# EAGLE design integrated_winglevlr_pow_and_cpu (EAGLE 9.6.2)
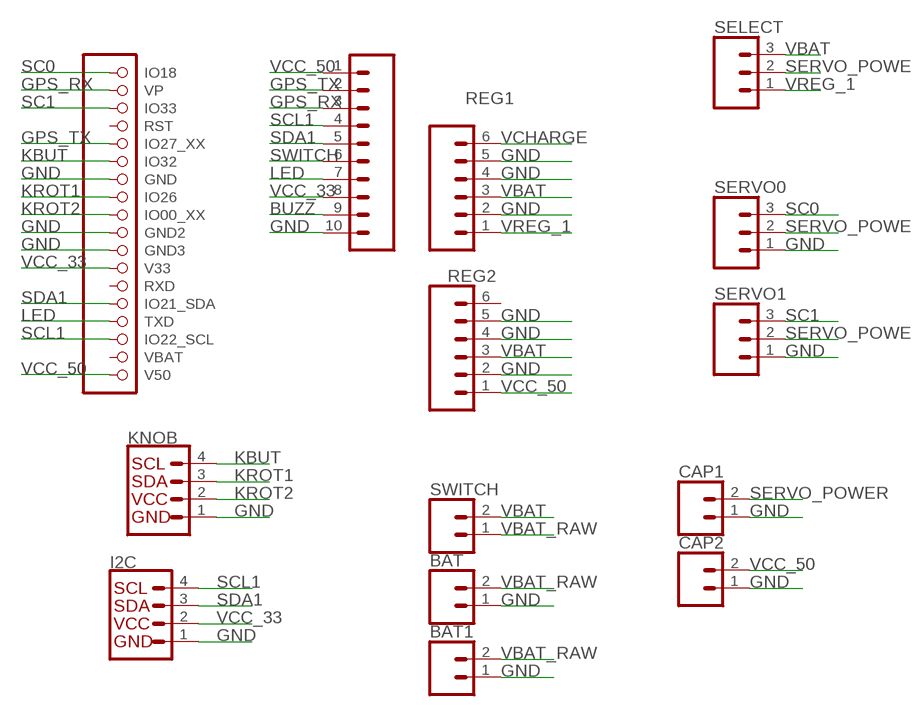
[diagram p0: schematic, sheet 1]

## Parts
BAT  CONN_02  [1X02]
BAT1  CONN_02  [1X02]
CAP1  CONN_02  [1X02]
CAP2  CONN_02  [1X02]
I2C  Vertical Qwiic Connector  QWIIC_CONNECTOR  [JST04_1MM_VERT]
J2  CONN_10  [1X10-1.25MM]
JP1  000_ESP32_D1MINI  [00_2X9]
KNOB  Vertical Qwiic Connector  QWIIC_CONNECTOR  [JST04_1MM_VERT]
REG1  CONN_06SILK_FEMALE_PTH  [1X06]
REG2  CONN_06SILK_FEMALE_PTH  [1X06]
SELECT  455-1750-1-ND  CONN_03  [1X03]
SERVO0  455-1750-1-ND  CONN_03  [1X03]
SERVO1  455-1750-1-ND  CONN_03  [1X03]
SWITCH  CONN_02  [1X02]

## Nets
BUZZ: J2.9
GND: BAT1.1 BAT.1 CAP1.1 CAP2.1 I2C.1 J2.10 JP1.7(GND) JP1.10(GND2) JP1.11(GND3) KNOB.1 REG1.2 REG1.4 REG1.5 REG2.2 REG2.4 REG2.5 SERVO0.1 SERVO1.1
GPS_RX: J2.3 JP1.2(VP)
GPS_TX: J2.2 JP1.5(IO27_XX)
KBUT: JP1.6(IO32) KNOB.4
KROT1: JP1.8(IO26) KNOB.3
KROT2: JP1.9(IO00_XX) KNOB.2
LED: J2.7 JP1.15(TXD)
SC0: JP1.1(IO18) SERVO0.3
SC1: JP1.3(IO33) SERVO1.3
SCL1: I2C.4 J2.4 JP1.16(IO22_SCL)
SDA1: I2C.3 J2.5 JP1.14(IO21_SDA)
SERVO_POWER: CAP1.2 SELECT.2 SERVO0.2 SERVO1.2
SWITCH: J2.6
VBAT: REG1.3 REG2.3 SELECT.3 SWITCH.2
VBAT_RAW: BAT1.2 BAT.2 SWITCH.1
VCC_33: I2C.2 J2.8 JP1.12(V33)
VCC_50: CAP2.2 J2.1 JP1.18(V50) REG2.1
VCHARGE: REG1.6
VREG_1: REG1.1 SELECT.1
Unconnected: JP1.4(RST) JP1.13(RXD) JP1.17(VBAT) REG2.6

## Library data of the parts
BAT BAT1 CAP1 CAP2 SWITCH = SparkFun-Connectors:CONN_02: Multi connection point. Often used as Generic Header-pin footprint for 0.1 inch spaced/style header connections On any of the 0.1 inch spaced packages, you can populate with these: Break Away Headers - Straight <https://www.sparkfun.com/products/116> (PRT-00116) Break Away Male Headers - Right Angle <https://www.sparkfun.com/products/553> (PRT-00553) Female Headers <https://www.sparkfun.com/products/115> (PRT-00115) Break Away Headers - Machine Pin <https://www.sparkfun.com/products/117> (PRT-00117) Break Away Female Headers - Swiss Machine Pin <https://www.sparkfun.com/products/743> (PRT-00743) For SCREWTERMINALS and SPRING TERMINALS visit here: Screw Terimnals on SparkFun.com <https://www.sparkfun.com/search/results?term=Screw+Terminals> (5mm/3.5mm/2.54mm spacing) This device is also useful as a general connection point to wire up your design to another part of your project. Our various solder wires solder well into these plated through hole pads. Hook-Up Wire - Assortment (Stranded, 22 AWG) <https://www.sparkfun.com/products/11375> (PRT-11375) Hook-Up Wire - Assortment (Solid Core, 22 AWG) <https://www.sparkfun.com/products/11367> (PRT-11367) View the entire wire category on our website here <https://www.sparkfun.com/categories/141> Special notes: Molex polarized connector foot print use with: PRT-08233 with associated crimp pins and housings. 2.54_SCREWTERM for use with PRT-10571. 3.5mm Screw Terminal footprints for PRT-08084 5mm Screw Terminal footprints for use with PRT-08432
I2C KNOB = SparkFun-Connectors:QWIIC_CONNECTOR: SparkFun I2C Standard Qwiic Connector An SMD 1mm pitch JST connector makes it easy and quick (get it? Qwiic?) to connect I2C devices to each other. The Qwiic system <http://www.sparkfun.com/qwiic> enables fast and solderless connection between popular platforms and various sensors and actuators. We carry 200mm <https://www.sparkfun.com/products/14204>, 100mm <https://www.sparkfun.com/products/14205>, 50mm <https://www.sparkfun.com/products/14206>, and breadboard friendly <https://www.sparkfun.com/products/14207> Qwiic cables. We also offer 10 pcs strips <https://www.sparkfun.com/products/14323> the SMD connectors.; PROD_ID: CONN-14483
J2 = SparkFun-Connectors:CONN_10: Multi connection point. Often used as Generic Header-pin footprint for 0.1 inch spaced/style header connections On any of the 0.1 inch spaced packages, you can populate with these: Break Away Headers - Straight <https://www.sparkfun.com/products/116> (PRT-00116) Break Away Male Headers - Right Angle <https://www.sparkfun.com/products/553> (PRT-00553) Female Headers <https://www.sparkfun.com/products/115> (PRT-00115) Break Away Headers - Machine Pin <https://www.sparkfun.com/products/117> (PRT-00117) Break Away Female Headers - Swiss Machine Pin <https://www.sparkfun.com/products/743> (PRT-00743) Arduino Stackable Header - 10 Pin <https://www.sparkfun.com/products/11376> (PRT-11376) For SCREWTERMINALS and SPRING TERMINALS visit here: Screw Terimnals on SparkFun.com <https://www.sparkfun.com/search/results?term=Screw+Terminals> (5mm/3.5mm/2.54mm spacing) This device is also useful as a general connection point to wire up your design to another part of your project. Our various solder wires solder well into these plated through hole pads. Hook-Up Wire - Assortment (Stranded, 22 AWG) <https://www.sparkfun.com/products/11375> (PRT-11375) Hook-Up Wire - Assortment (Solid Core, 22 AWG) <https://www.sparkfun.com/products/11367> (PRT-11367) View the entire wire category on our website here <https://www.sparkfun.com/categories/141> Special notes: Molex polarized connector foot print use with SKU : PRT-08231 with associated crimp pins and housings. 1MM SMD Version SKU: PRT-10208 NOTES ON THE VARIANTS LOCK and LOCK_LONGPADS... This footprint was designed to help hold the alignment of a through-hole component (i.e. 6-pin header) while soldering it into place. You may notice that each hole has been shifted either up or down by 0.005 of an inch from it's more standard position (which is a perfectly straight line). This slight alteration caused the pins (the squares in the middle) to touch the edges of the holes. Because they are alternating, it causes a "brace" to hold the component in place. 0.005 has proven to be the perfect amount of "off-center" position when using our standard breakaway headers. Although looks a little odd when you look at the bare footprint, once you have a header in there, the alteration is very hard to notice. Also,if you push a header all the way into place, it is covered up entirely on the bottom side.
JP1 = microbuilder:000_ESP32_D1MINI: PIN HEADER
REG1 REG2 = SparkFun-Connectors:CONN_06: Multi connection point. Often used as Generic Header-pin footprint for 0.1 inch spaced/style header connections On any of the 0.1 inch spaced packages, you can populate with these: Break Away Headers - Straight <https://www.sparkfun.com/products/116> (PRT-00116) Break Away Male Headers - Right Angle <https://www.sparkfun.com/products/553> (PRT-00553) Female Headers <https://www.sparkfun.com/products/115> (PRT-00115) Break Away Headers - Machine Pin <https://www.sparkfun.com/products/117> (PRT-00117) Break Away Female Headers - Swiss Machine Pin <https://www.sparkfun.com/products/743> (PRT-00743) Arduino Stackable Header - 6 Pin <https://www.sparkfun.com/products/9280> (PRT-09280) For SCREWTERMINALS and SPRING TERMINALS visit here: Screw Terimnals on SparkFun.com <https://www.sparkfun.com/search/results?term=Screw+Terminals> (5mm/3.5mm/2.54mm spacing) This device is also useful as a general connection point to wire up your design to another part of your project. Our various solder wires solder well into these plated through hole pads. Hook-Up Wire - Assortment (Stranded, 22 AWG) <https://www.sparkfun.com/products/11375> (PRT-11375) Hook-Up Wire - Assortment (Solid Core, 22 AWG) <https://www.sparkfun.com/products/11367> (PRT-11367) View the entire wire category on our website here <https://www.sparkfun.com/categories/141>; PROD_ID: CONN-08437
SELECT SERVO0 SERVO1 = SparkFun-Connectors:CONN_03: Multi connection point. Often used as Generic Header-pin footprint for 0.1 inch spaced/style header connections On any of the 0.1 inch spaced packages, you can populate with these: Break Away Headers - Straight <https://www.sparkfun.com/products/116> (PRT-00116) Break Away Male Headers - Right Angle <https://www.sparkfun.com/products/553> (PRT-00553) Female Headers <https://www.sparkfun.com/products/115> (PRT-00115) Break Away Headers - Machine Pin <https://www.sparkfun.com/products/117> (PRT-00117) Break Away Female Headers - Swiss Machine Pin <https://www.sparkfun.com/products/743> (PRT-00743) Stackable Header - 3 Pin (Female, 0.1") <https://www.sparkfun.com/products/13875> (PRT-13875) For SCREWTERMINALS and SPRING TERMINALS visit here: Screw Terimnals on SparkFun.com <https://www.sparkfun.com/search/results?term=Screw+Terminals> (5mm/3.5mm/2.54mm spacing) This device is also useful as a general connection point to wire up your design to another part of your project. Our various solder wires solder well into these plated through hole pads. Hook-Up Wire - Assortment (Stranded, 22 AWG) <https://www.sparkfun.com/products/11375> (PRT-11375) Hook-Up Wire - Assortment (Solid Core, 22 AWG) <https://www.sparkfun.com/products/11367> (PRT-11367) View the entire wire category on our website here <https://www.sparkfun.com/categories/141> Special notes: Molex polarized connector foot print use with SKU : PRT-08232 with associated crimp pins and housings.; PROD_ID: XXX-00000

## Net classes
3 hc: width 0.762 mm

## Board
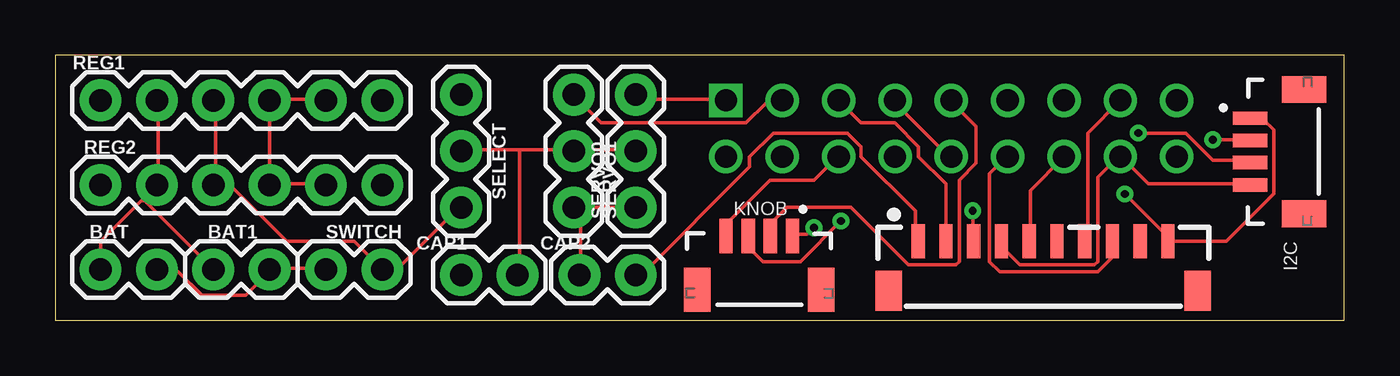
[diagram p1: board, top side]
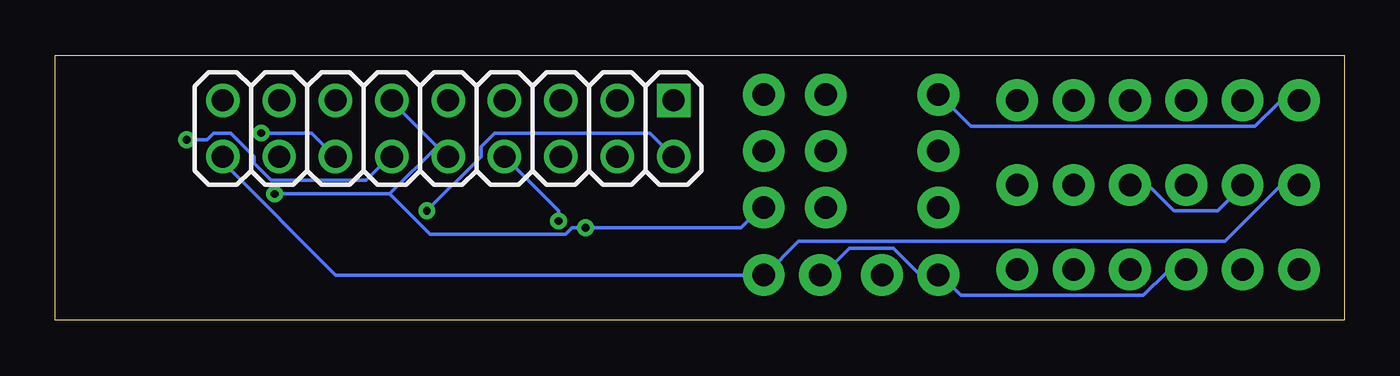
[diagram p2: board, bottom side, seen from below]

Size 58.09 x 11.93 mm. Coordinates in mm from the lower left corner, seen from the top.
Outline: 0,0 58.09,0 58.09,11.93 0,11.93 0,0
Copper layers (1*16): Top 0.035mm / dielectric 1.5mm / Bottom 0.035mm
Design rules "default": minimum track width 6mil, minimum drill 0.35mm, track to track 6mil, track to pad 6mil, pad to pad 6mil, via to via 6mil, smd to smd 6mil, copper to edge 40mil, drill to drill 6mil, minimum pad ring 10mil, minimum via ring 8mil, stop-mask expansion 4mil, vias tented up to drill 0mil, thermal gap 10mil

### Footprints (pad centres in the part's own frame; a part is rotated, then mirrored left to right if it is on the bottom)
1X02 = drill 1.016 pad 1.88: 1 0,0; 2 2.54,0
JST04_1MM_VERT = smd 0.6 x 1.55: 1 -1.478,0.775; 2 -0.478,0.775; 3 0.522,0.775; 4 1.522,0.775 | smd 1.2 x 2: NC1 -2.778,3.2; NC2 2.822,3.2
1X10-1.25MM = smd 0.6 x 1.55: 1 -3.778,2.54; 2 -2.528,2.54; 3 -1.278,2.54; 4 -0.028,2.54; 5 1.222,2.54; 6 2.472,2.54; 7 3.722,2.54; 8 4.972,2.54; 9 6.222,2.54; 10 7.472,2.54 | smd 1.2 x 1.8: P$1 -5.11,0.315; P$3 8.822,0.315
00_2X9 = drill 1 square: 1 0,0 | drill 1: 2 0,2.54; 3 2.54,0; 4 2.54,2.54; 5 5.08,0; 6 5.08,2.54; 7 7.62,0; 8 7.62,2.54; 9 10.16,0; 10 10.16,2.54; 11 12.7,0; 12 12.7,2.54; 13 15.24,0; 14 15.24,2.54; 15 17.78,0; 16 17.78,2.54; 17 20.32,0; 18 20.32,2.54
1X06 = drill 1.016 pad 1.88: 1 0,0; 2 2.54,0; 3 5.08,0; 4 7.62,0; 5 10.16,0; 6 12.7,0
1X03 = drill 1.016 pad 1.88: 1 0,0; 2 2.54,0; 3 5.08,0

### Placement (x,y rotation side)
BAT  2.03,2.29 0 top
BAT1  7.11,2.29 0 top
CAP1  18.29,2.03 0 top
CAP2  23.62,2.03 0 top
I2C  53.09,7.62 270 top
J2  42.67,1.02 0 top
JP1  30.23,9.91 180 bottom
KNOB  31.75,4.57 180 top
REG1  2.03,9.91 0 top
REG2  2.03,6.1 0 top
SELECT  18.29,10.16 270 top
SERVO0  26.16,5.08 90 top
SERVO1  23.37,5.08 90 top
SWITCH  12.19,2.29 0 top

### Tracks (layer width: path | path; a pad name or v marks a point on that pad's centre or on a via)
GND  (via drill 0.35)
  Top 0.152: 9.65,6.15 12.09,6.15 REG2.5 | REG1.5 12.09,9.96 9.65,9.96 REG1.4 9.65,6.15 | 9.65,6.15 REG2.4 | BAT.1 2.03,3.56 3.86,5.38 | 3.86,5.38 REG2.2 4.62,6.15 4.62,9.8 REG1.2 | BAT1.1 4.01,5.38 3.86,5.38 | v34.19,4.17 33.88,3.86 33.27,3.86 KNOB.1 | SERVO0.1 23.67,5.08 | 23.67,5.08 23.67,2.03 CAP2.1 | 23.67,5.08 SERVO1.1 | I2C.1 54,9.04 54.46,9.04 54.91,8.58 54.91,5.69 52.78,3.56 J2.10 50.04,3.56 50.04,3.86 v48.21,5.69 | JP1.7 37.85,9.8 40.28,7.37 JP1.10
  Bottom 0.152: REG2.4 9.65,5.99 8.74,5.99 7.67,4.93 5.69,4.93 4.62,5.99 REG2.2 | CAP2.1 23.52,2.03 22.3,3.25 20.32,3.25 19.1,2.03 CAP1.1 18.19,2.03 17.27,1.12 9.04,1.12 7.98,2.18 7.21,2.18 BAT1.1 | SERVO0.1 26.26,5.08 27.18,4.17 v34.19,4.17 34.8,4.17 35.1,3.86 41.2,3.86 43.03,5.69 | 40.89,7.82 42.88,9.8 JP1.11 | 40.89,7.82 40.44,7.37 JP1.10 40.89,7.82 | 43.03,5.69 v48.21,5.69 | 40.89,7.82 43.03,5.69
GPS_RX  (via drill 0.35)
  Top 0.152: v41.35,4.93 41.35,3.56 J2.3
  Bottom 0.152: v41.35,4.93 38.91,7.37 38.91,7.82 38.3,8.43 31.29,8.43 JP1.2
GPS_TX
  Top 0.152: JP1.5 36.32,8.89 37.85,8.89 38.91,7.82 38.91,7.37 40.13,6.15 J2.2
KBUT
  Top 0.152: KNOB.4 30.38,3.86 30.38,4.47 32.21,6.3 34.19,6.3 35.26,7.37 JP1.6
KROT1  (via drill 0.35)
  Top 0.152: v35.41,4.47 33.58,2.64 31.9,2.64 31.29,3.25 31.29,3.71 KNOB.3
  Bottom 0.152: v35.41,4.47 35.41,4.93 JP1.8
KROT2
  Top 0.152: KNOB.2 32.36,3.86 32.36,4.47 32.97,5.08 35.87,5.08 38.46,2.49 40.59,2.49 40.74,2.64 40.74,6.3 41.5,7.06 41.5,8.74 40.44,9.8 JP1.9
LED
  Top 0.152: JP1.15 46.53,8.43 46.53,3.56 J2.7
SC0
  Top 0.152: JP1.1 30.23,9.96 26.42,9.96 26.26,10.11 SERVO0.3
SC1
  Top 0.152: JP1.3 32.66,9.8 32.05,9.8 31.14,8.89 24.59,8.89 23.37,10.11 SERVO1.3
SCL1
  Top 0.152: J2.4 42.72,3.56 42.72,3.25 43.48,2.49 46.84,2.49 46.99,2.64 46.99,6.45 47.9,7.37 JP1.16 48.06,7.37 49.28,6.15 53.85,6.15 I2C.4
SDA1  (via drill 0.35)
  Top 0.152: JP1.14 43.94,5.84 43.94,3.56 J2.5 | v48.82,8.43 50.95,8.43 52.17,7.21 53.85,7.21 I2C.3
  Bottom 0.152: v48.82,8.43 46.53,8.43 JP1.14
SERVO_POWER
  Top 0.152: 23.37,7.67 20.93,7.67 | 20.93,7.67 18.34,7.67 SELECT.2 | 20.93,7.67 20.93,2.03 CAP1.2 | 23.37,7.67 26.11,7.67 SERVO0.2 | 23.37,7.67 SERVO1.2
VBAT
  Top 0.152: REG1.3 7.21,9.8 7.21,6.15 REG2.3 7.21,5.99 7.98,5.99 10.41,3.56 13.46,3.56 SWITCH.2 14.83,2.34 15.44,2.34 18.19,5.08 SELECT.3
VBAT_RAW
  Top 0.152: BAT.2 4.62,2.18 5.54,2.18 6.6,1.12 8.58,1.12 9.65,2.18 BAT1.2 9.65,2.34 12.09,2.34 SWITCH.1
VCC_33  (via drill 0.35)
  Top 0.152: J2.8 47.6,3.56 47.6,2.79 46.99,2.18 42.57,2.18 42.11,2.64 42.11,6.6 42.88,7.37 JP1.12 | v52.17,8.13 53.85,8.13 I2C.2
  Bottom 0.152: v52.17,8.13 51.26,8.13 50.95,8.43 50.19,8.43 49.12,7.37 49.12,7.06 48.36,6.3 44.09,6.3 43.03,7.37 JP1.12
VCC_50
  Top 0.152: CAP2.2 26.42,2.03 31.29,6.91 31.29,7.37 32.36,8.43 35.71,8.43 36.32,7.82 36.32,7.37 38.76,4.93 38.76,3.56 J2.1
  Bottom 0.152: JP1.18 50.5,7.37 50.5,7.06 45.47,2.03 CAP2.2 26.11,2.03 24.59,3.56 5.38,3.56 2.95,5.99 2.03,5.99 REG2.1
VREG_1
  Bottom 0.152: REG1.1 2.03,9.8 2.95,9.8 4.01,8.74 16.82,8.74 18.19,10.11 SELECT.1